# Altium schematic sheet OutPut_LED.SchDoc
size A4
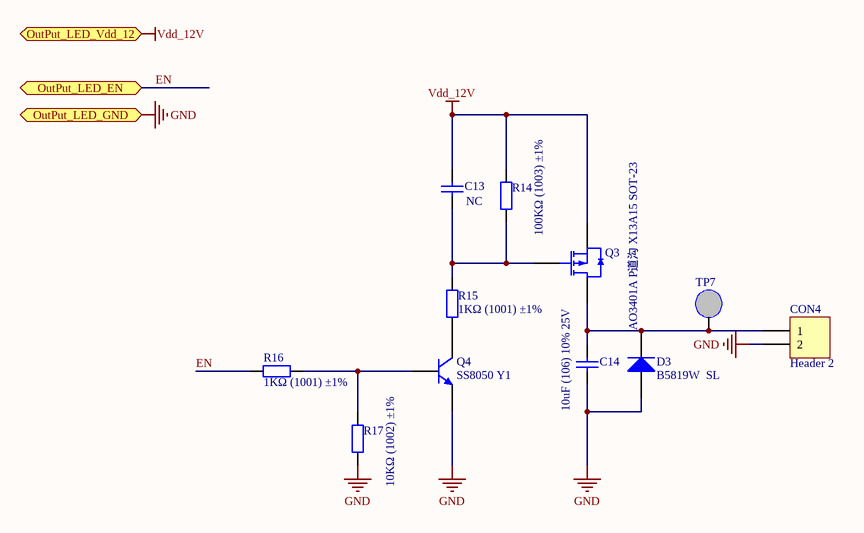
[diagram p0: OutPut_LED.SchDoc]

## Parts
C13  NC  [0805_C]
C14  10uF (106) 10% 25V  [0805_C]
CON4  Header 2  [PH2.0-WS-2P]
D3  B5819W  SL  [SOD-123]
Q3  AO3401A P道沟 X13A15 SOT-23  [SOT-23-3L]
Q4  SS8050 Y1  [SOT-23(SOT-23-3)]
R14  100KΩ (1003) ±1%  [0805_R]
R15  1KΩ (1001) ±1%  [0805_R]
R16  1KΩ (1001) ±1%  [0805_R]
R17  10KΩ (1002) ±1%  [0805_R]
TP7  TP  [TP]  (value not drawn)

## Ports
OutPut_LED_EN, OutPut_LED_GND, OutPut_LED_Vdd_12

## Nets
GND: C14.1 CON4.2 D3.1(A) Q4.2(E) R17.1 ; port OutPut_LED_GND
Vdd_12V: C13.2 Q3.2(S) R14.2 ; port OutPut_LED_Vdd_12
EN: R16.1 ; port OutPut_LED_EN
NetC13_1: C13.1 Q3.1(G) R14.1 R15.1
NetC14_2: C14.2 CON4.1 D3.2(K) Q3.3(D) TP7.1
NetQ4_1: Q4.1(B) R16.2 R17.2
NetQ4_3: Q4.3(C) R15.2

## Library data of the parts
C13 = 0805 22uF (226) 20% 25V: 贴片电容; ComponentLink1Description: 供应商链接; ComponentLink1URL: http://www.szlcsc.com/product/details_46786.html; Package: 0805; Supplier: LC; SuppliersPartNumber: C45783
C14 = 0805 10uF (106) 10% 25V: 贴片电容; ComponentLink1Description: 供应商链接; ComponentLink1URL: http://www.szlcsc.com/product/details_16532.html; Package: 0805; Supplier: LC; SuppliersPartNumber: C15850
CON4 = Header 2: Header, 2-Pin; LatestRevisionDate: 17-Jul-2002; LatestRevisionNote: Re-released for DXP Platform.; Publisher: Altium Limited
D3 = SOD-123 B5819W  SL: 肖特基二极管; ComponentLink1Description: 供应商链接; ComponentLink1URL: http://www.szlcsc.com/product/details_9093.html; Package: SOD-123; Supplier: LC; SuppliersPartNumber: C8598
Q3 = AO3401A P道沟 X13A15 SOT-23: MOS(场效应管); ComponentLink1Description: 供应商链接; ComponentLink1URL: http://www.szlcsc.com/product/details_15801.html; Package: SOT-23; Supplier: LC; SuppliersPartNumber: C15127
Q4 = SOT-23 SS8050 Y1: 三极管; ComponentLink1Description: 供应商链接; ComponentLink1URL: http://www.szlcsc.com/product/details_2507.html; Package: SOT-23; Supplier: LC; SuppliersPartNumber: C2150
R14 = 0805 100KΩ (1003) 1%: 贴片电阻; ComponentLink1Description: 供应商链接; ComponentLink1URL: http://www.szlcsc.com/product/details_18095.html; Package: 0805; Supplier: LC; SuppliersPartNumber: C17407
R15 R16 = 0805 1KΩ (1001) 1%: 贴片电阻; ComponentLink1Description: 供应商链接; ComponentLink1URL: http://www.szlcsc.com/product/details_18201.html; Package: 0805; Supplier: LC; SuppliersPartNumber: C17513
R17 = 0805 10KΩ (1002) 1%: 贴片电阻; ComponentLink1Description: 供应商链接; ComponentLink1URL: http://www.szlcsc.com/product/details_18102.html; Package: 0805; Supplier: LC; SuppliersPartNumber: C17414